# Altium schematic sheet FPGA-Oscilloscope-Analog.SchDoc
size C
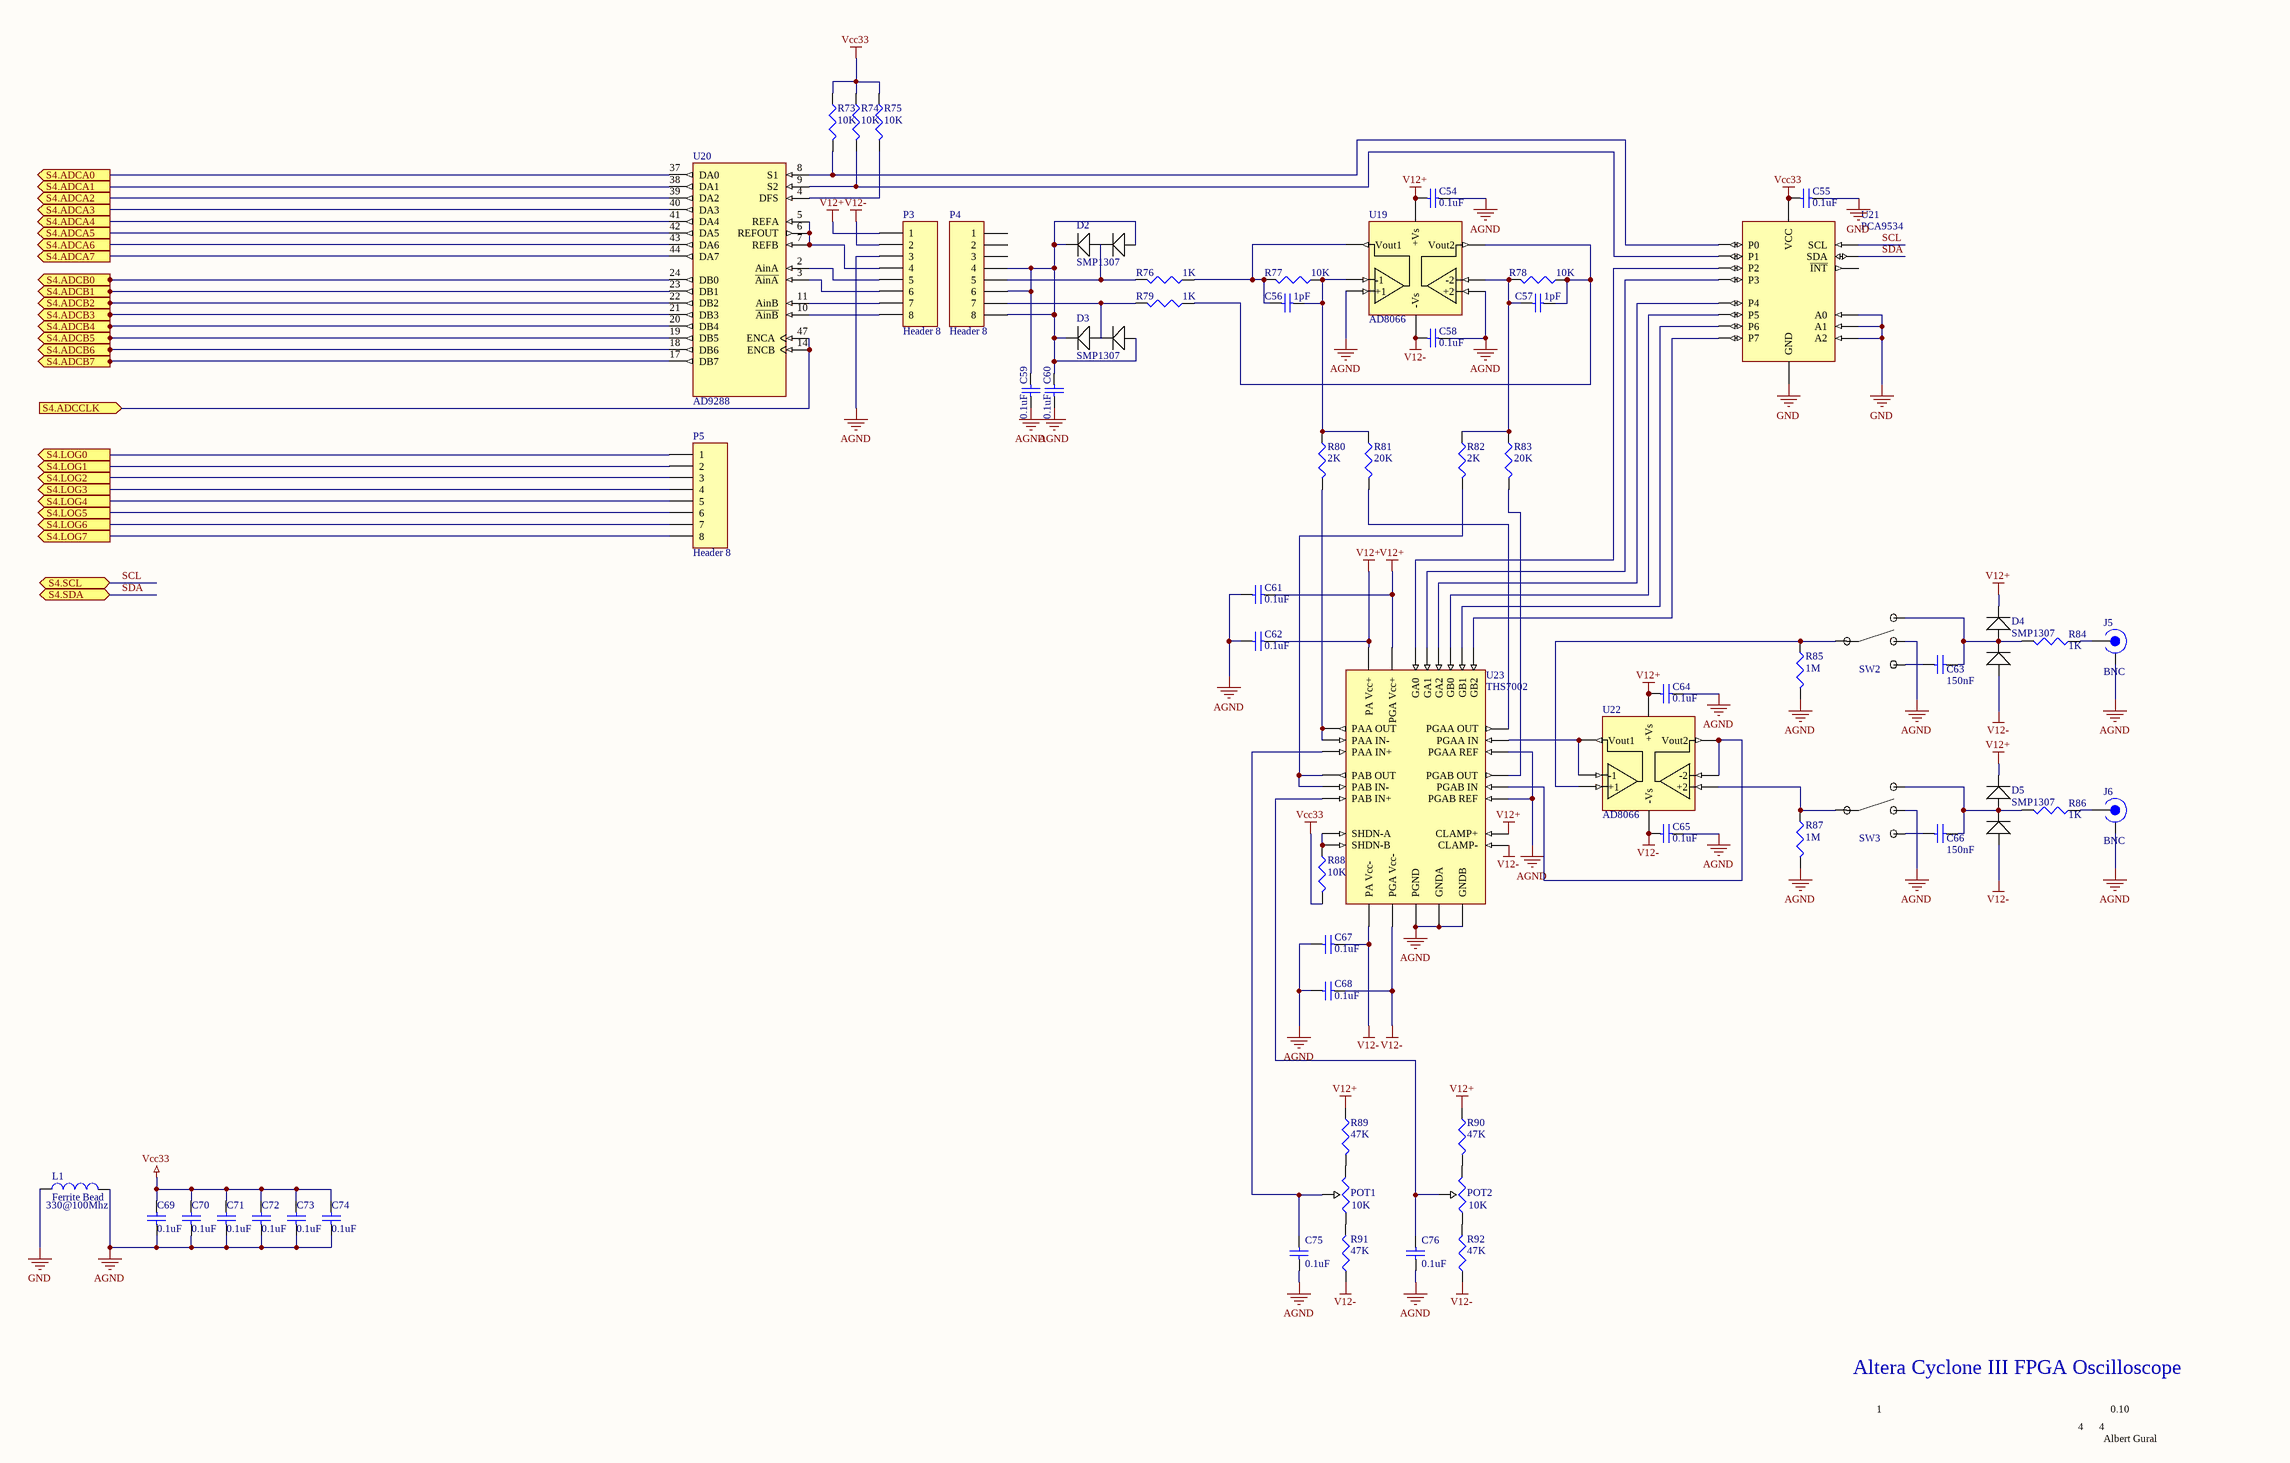
[diagram p0: FPGA-Oscilloscope-Analog.SchDoc]

## Parts
C54  value 0.1uF  [1608[0603]]
C55  value 0.1uF  [1608[0603]]
C56  value 1pF  [1608[0603]]
C57  value 1pF  [1608[0603]]
C58  value 0.1uF  [1608[0603]]
C59  value 0.1uF  [1608[0603]]
C60  value 0.1uF  [1608[0603]]
C61  value 0.1uF  [1608[0603]]
C62  value 0.1uF  [1608[0603]]
C63  value 150nF  [1608[0603]]
C64  value 0.1uF  [1608[0603]]
C65  value 0.1uF  [1608[0603]]
C66  value 150nF  [1608[0603]]
C67  value 0.1uF  [1608[0603]]
C68  value 0.1uF  [1608[0603]]
C69  value 0.1uF  [1608[0603]]
C70  value 0.1uF  [1608[0603]]
C71  value 0.1uF  [1608[0603]]
C72  value 0.1uF  [1608[0603]]
C73  value 0.1uF  [1608[0603]]
C74  value 0.1uF  [1608[0603]]
C75  value 0.1uF  [1608[0603]]
C76  value 0.1uF  [1608[0603]]
D2  SMP1307  [SOT-23-3]
D3  SMP1307  [SOT-23-3]
D4  SMP1307  [SOT-23-3]
D5  SMP1307  [SOT-23-3]
J5  BNC  [AMP31-5540]
J6  BNC  [AMP31-5540]
L1  Ferrite Bead  value 330@100Mhz  [1608[0603]]
P3  Header 8  [HDR1X8]
P4  Header 8  [HDR1X8]
P5  Header 8  [HDR1X8]
POT1  10K  [POT-3]
POT2  10K  [POT-3]
R73  10K  [1608[0603]]
R74  10K  [1608[0603]]
R75  10K  [1608[0603]]
R76  1K  [1608[0603]]
R77  10K  [1608[0603]]
R78  10K  [1608[0603]]
R79  1K  [1608[0603]]
R80  2K  [1608[0603]]
R81  20K  [1608[0603]]
R82  2K  [1608[0603]]
R83  20K  [1608[0603]]
R84  1K  [1608[0603]]
R85  1M  [1608[0603]]
R86  1K  [1608[0603]]
R87  1M  [1608[0603]]
R88  10K  [1608[0603]]
R89  47K  [1608[0603]]
R90  47K  [1608[0603]]
R91  47K  [1608[0603]]
R92  47K  [1608[0603]]
SW2  CL-SB-13B-02T  [SP3T]  (value not drawn)
SW3  CL-SB-13B-02T  [SP3T]  (value not drawn)
U19  AD8066  [MSOP-8]
U20  AD9288  [QFP24-7x7]
U21  PCA9534  [TSSOP16]
U22  AD8066  [MSOP-8]
U23  THS7002  [SOP28]

## Ports
S4.ADCA0 (out), S4.ADCA1 (out), S4.ADCA2 (out), S4.ADCA3 (out), S4.ADCA4 (out), S4.ADCA5 (out), S4.ADCA6 (out), S4.ADCA7 (out), S4.ADCB0 (out), S4.ADCB1 (out), S4.ADCB2 (out), S4.ADCB3 (out), S4.ADCB4 (out), S4.ADCB5 (out), S4.ADCB6 (out), S4.ADCB7 (out), S4.ADCCLK (in), S4.LOG0 (out), S4.LOG1 (out), S4.LOG2 (out), S4.LOG3 (out), S4.LOG4 (out), S4.LOG5 (out), S4.LOG6 (out), S4.LOG7 (out), S4.SCL (bidir), S4.SDA (bidir)

## Nets
AGND: C54.1 C58.1 C59.1 C60.1 C61.2 C62.2 C64.1 C65.1 C67.2 C68.2 C69.1 C70.1 C71.1 C72.1 C73.1 C74.1 C75.1 C76.1 J5.2(SHIELD) J6.2(SHIELD) L1.2 P3.3 R85.2 R87.2 SW2.2 SW3.2 U19.3(+1) U19.5(+2) U20.1(AGND) U20.12(AGND) U20.16(AGND) U20.27(AGND) U20.29(AGND) U20.32(AGND) U20.34(AGND) U20.45(AGND) U23.1(GNDA) U23.2(PGAA_REF) U23.13(PGAB_REF) U23.14(GNDB) U23.PGND
GND: C55.1 L1.1 U21.1(A0) U21.2(A1) U21.3(A2) U21.8(GND)
V12+: C54.2 C61.1 C62.1 C64.2 D4.2 D5.2 P3.1 R89.1 R90.1 U19.8(+Vs) U22.8(+Vs) U23.8(PA_Vcc+) U23.20(CLAMP+) U23.21(PGA_Vcc+)
V12-: C58.2 C65.2 C67.1 C68.1 D4.1 D5.1 P3.2 R91.1 R92.1 U19.4(-Vs) U22.4(-Vs) U23.7(PA_Vcc-) U23.22(PGA_Vcc-) U23.23(CLAMP-)
Vcc33: C55.2 C69.2 C70.2 C71.2 C72.2 C73.2 C74.2 R73.1 R74.1 R75.1 R88.2 U20.13(VD) U20.15(VDD) U20.28(VDD) U20.30(VD) U20.31(VD) U20.33(VDD) U20.46(VDD) U20.48(VD) U21.16(VCC)
S4.ADCA0: U20.37(DA0) ; port S4.ADCA0
S4.ADCA1: U20.38(DA1) ; port S4.ADCA1
S4.ADCA2: U20.39(DA2) ; port S4.ADCA2
S4.ADCA3: U20.40(DA3) ; port S4.ADCA3
S4.ADCA4: U20.41(DA4) ; port S4.ADCA4
S4.ADCA5: U20.42(DA5) ; port S4.ADCA5
S4.ADCA6: U20.43(DA6) ; port S4.ADCA6
S4.ADCA7: U20.44(DA7) ; port S4.ADCA7
S4.ADCB0: U20.24(DB0) ; port S4.ADCB0
S4.ADCB1: U20.23(DB1) ; port S4.ADCB1
S4.ADCB2: U20.22(DB2) ; port S4.ADCB2
S4.ADCB3: U20.21(DB3) ; port S4.ADCB3
S4.ADCB4: U20.20(DB4) ; port S4.ADCB4
S4.ADCB5: U20.19(DB5) ; port S4.ADCB5
S4.ADCB6: U20.18(DB6) ; port S4.ADCB6
S4.ADCB7: U20.17(DB7) ; port S4.ADCB7
S4.ADCCLK: U20.14(ENCB) U20.47(ENCA) ; port S4.ADCCLK
S4.LOG0: P5.1 ; port S4.LOG0
S4.LOG1: P5.2 ; port S4.LOG1
S4.LOG2: P5.3 ; port S4.LOG2
S4.LOG3: P5.4 ; port S4.LOG3
S4.LOG4: P5.5 ; port S4.LOG4
S4.LOG5: P5.6 ; port S4.LOG5
S4.LOG6: P5.7 ; port S4.LOG6
S4.LOG7: P5.8 ; port S4.LOG7
SCL: U21.14(SCL) ; port S4.SCL
SDA: U21.15(SDA) ; port S4.SDA
NetC56_1: C56.1 R77.1 R80.1 R81.1 U19.2(-1)
NetC56_2: C56.2 R76.1 R77.2 U19.1(Vout1)
NetC57_1: C57.1 R78.1 R79.1 U19.7(Vout2)
NetC57_2: C57.2 R78.2 R82.1 R83.1 U19.6(-2)
NetC59_2: C59.2 C60.2 D2.1 D2.2 D3.1 D3.2 P4.4 P4.6 P4.8
NetC63_1: C63.1 D4.3 R84.2 SW2.1
NetC63_2: C63.2 SW2.4
NetC66_1: C66.1 D5.3 R86.2 SW3.1
NetC66_2: C66.2 SW3.4
NetC75_2: C75.2 POT1.2 U23.6(PAA_IN+)
NetC76_2: C76.2 POT2.2 U23.9(PAB_IN+)
NetD2_3: D2.3 P4.5 R76.2
NetD3_3: D3.3 P4.7 R79.2
NetJ5_1: J5.1(SIGNAL) R84.1
NetJ6_1: J6.1(SIGNAL) R86.1
NetP3_4: P3.4 U20.5(REFA) U20.6(REFOUT) U20.7(REFB)
NetP3_5: P3.5 U20.2(AinA)
NetP3_6: P3.6 U20.3(~{AinA})
NetP3_7: P3.7 U20.11(AinB)
NetP3_8: P3.8 U20.10(~{AinB})
NetPOT1_1: POT1.1 R89.2
NetPOT1_3: POT1.3 R91.2
NetPOT2_1: POT2.1 R90.2
NetPOT2_3: POT2.3 R92.2
NetR73_2: R73.2 U20.8(S1) U21.4(P0)
NetR74_2: R74.2 U20.9(S2) U21.5(P1)
NetR75_2: R75.2 U20.4(DFS)
NetR80_2: R80.2 U23.4(PAA_OUT) U23.5(PAA_IN-)
NetR81_2: R81.2 U23.24(PGAA_OUT)
NetR82_2: R82.2 U23.10(PAB_IN-) U23.11(PAB_OUT)
NetR83_2: R83.2 U23.19(PGAB_OUT)
NetR85_1: R85.1 SW2.3 U22.3(+1)
NetR87_1: R87.1 SW3.3 U22.5(+2)
NetR88_1: R88.1 U23.18(SHDN-B) U23.25(SHDN-A)
NetU21_6: U21.6(P2) U23.28(GA0)
NetU21_7: U21.7(P3) U23.27(GA1)
NetU21_9: U21.9(P4) U23.26(GA2)
NetU21_10: U21.10(P5) U23.15(GB0)
NetU21_11: U21.11(P6) U23.16(GB1)
NetU21_12: U21.12(P7) U23.17(GB2)
NetU22_1: U22.1(Vout1) U22.2(-1) U23.3(PGAA_IN)
NetU22_6: U22.6(-2) U22.7(Vout2) U23.12(PGAB_IN)

Not connected (* = marked no-connect by the designer): P4 1 2 3; U21 13(~{INT})

## Notes on the sheet
- Altera Cyclone III FPGA Oscilloscope
- 1
- 4
- Albert Gural
- 0.10

## Library data of the parts
C54-C76 = Cap Semi: Capacitor (Semiconductor SIM Model); Published: 8-Jun-2000; LatestRevisionDate: 29-May-2009; LatestRevisionNote: IPC-7351 Footprint Added.; PackageReference: C1206; Publisher: Altium Limited; PackageDescription: Chip Capacitor
D2-D5 = SMP1307-005LF
J5 J6 = BNC: BNC Connector
L1 = Inductor: Code_IEC: 1005; Published: 8-Jun-2000; LatestRevisionDate: 29-May-2009; LatestRevisionNote: IPC-7351 Footprint Added.; PackageReference: 0402-A; Publisher: Altium Limited; PackageDescription: Chip Inductor; Code_JEITA: 0402
P3-P5 = Header 8: Header, 8-Pin; LatestRevisionDate: 17-Jul-2002; LatestRevisionNote: Re-released for DXP Platform.; Publisher: Altium Limited
POT1 POT2 = Potentiometer
R73-R92 = RES1
U20 = AD9288: Dual Channel ADC